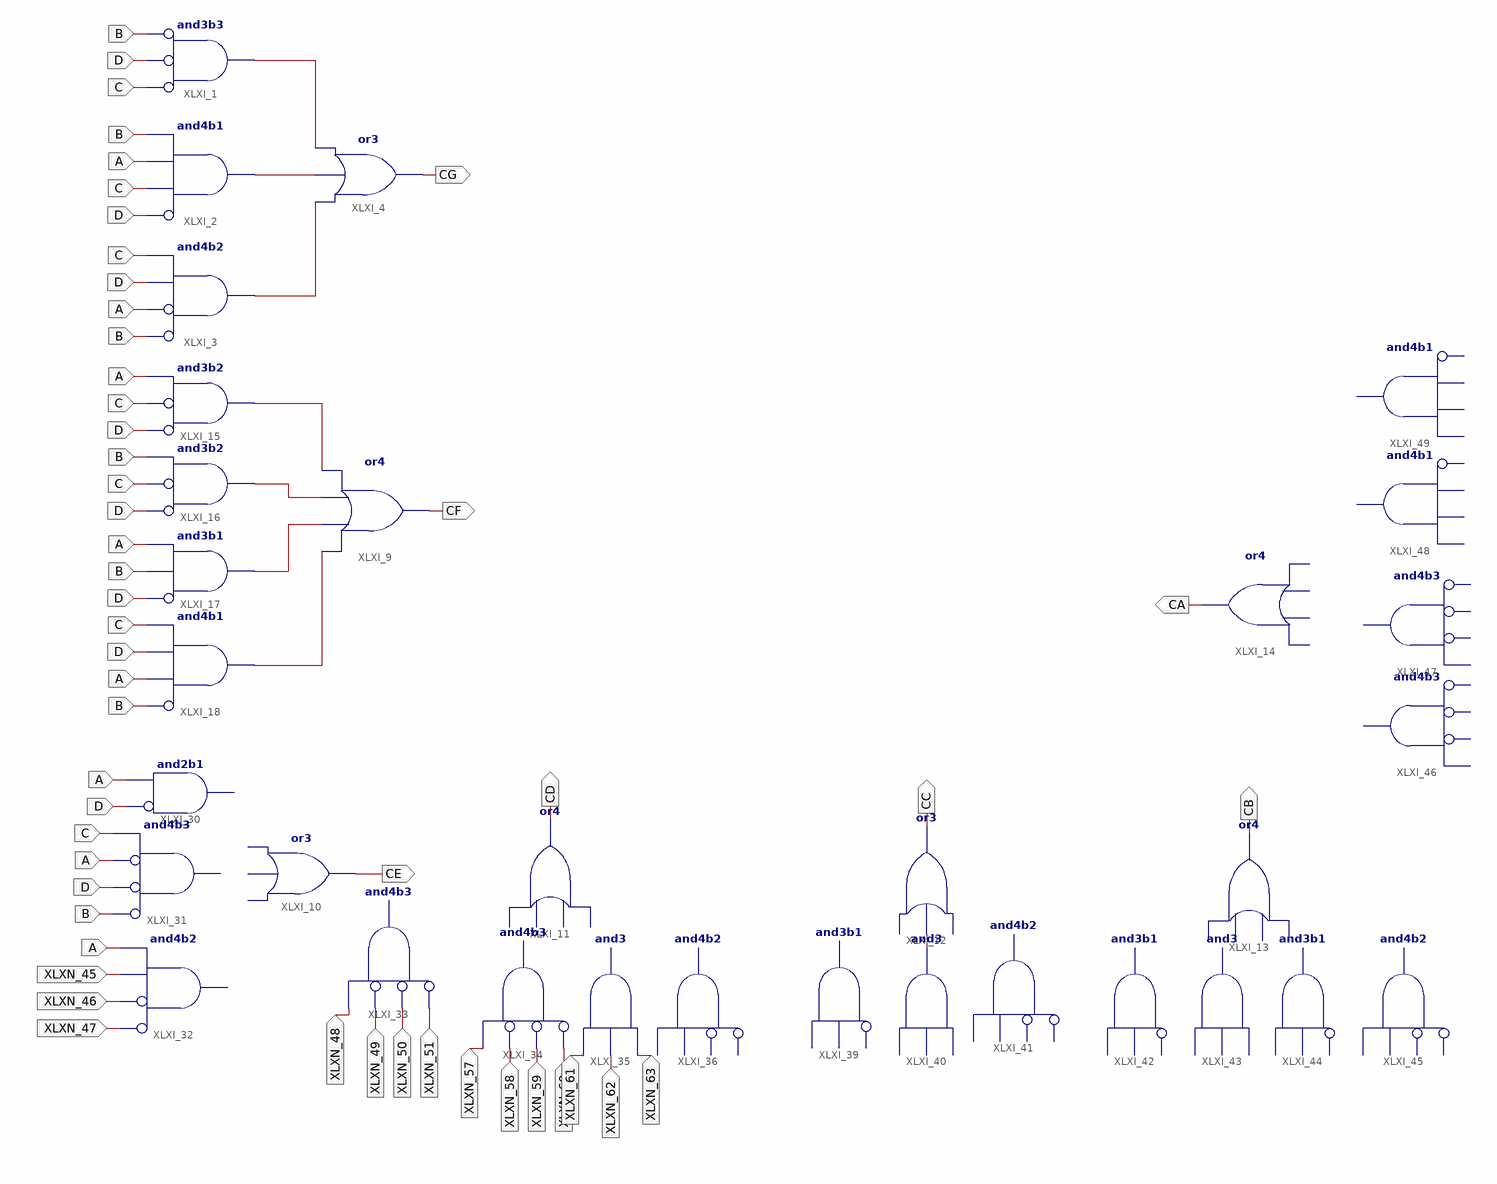
[diagram p0: schematic sheet 1]
// Xilinx ISE schematic Display.sch (spartan3e) as structural Verilog: 32 symbols, 25 ports
module Display (
  input  B,
  input  D,
  input  C,
  input  A,
  input  XLXN_45,
  input  XLXN_46,
  input  XLXN_47,
  input  XLXN_48,
  input  XLXN_49,
  input  XLXN_50,
  input  XLXN_51,
  input  XLXN_57,
  input  XLXN_58,
  input  XLXN_59,
  input  XLXN_60,
  input  XLXN_61,
  input  XLXN_62,
  input  XLXN_63,
  output CD,
  output CA,
  output CE,
  output CB,
  output CC,
  output CG,
  output CF
);

  wire XLXN_13, XLXN_64, XLXN_65, XLXN_66, XLXN_90, XLXN_91, XLXN_92, XLXN_93;

  // or4 XLXI_11 has open pins: I0=open, I1=open, I2=open, I3=open, O=CD
  // or4 XLXI_14 has open pins: I0=open, I1=open, I2=open, I3=open, O=CA
  // or3 XLXI_10 has open pins: I0=open, I1=open, I2=open, O=CE
  // and2b1 XLXI_30 has open pins: I0=D, I1=A, O=open
  // and4b3 XLXI_31 has open pins: I0=B, I1=D, I2=A, I3=C, O=open
  // and4b2 XLXI_32 has open pins: I0=XLXN_47, I1=XLXN_46, I2=XLXN_45, I3=A, O=open
  // and4b3 XLXI_34 has open pins: I0=XLXN_60, I1=XLXN_59, I2=XLXN_58, I3=XLXN_57, O=open
  // and3 XLXI_35 has open pins: I0=XLXN_63, I1=XLXN_62, I2=XLXN_61, O=open
  // and4b2 XLXI_36 is placed but not wired
  // or4 XLXI_13 has open pins: I0=open, I1=open, I2=open, I3=open, O=CB
  buf XLXI_12 (CC, XLXN_13);  // or3 open: I0, I2
  // and3b1 XLXI_39 is placed but not wired
  // and3 XLXI_40 has open pins: I0=open, I1=open, I2=open, O=XLXN_13
  // and4b2 XLXI_41 is placed but not wired
  // and3b1 XLXI_42 is placed but not wired
  // and3 XLXI_43 is placed but not wired
  // and3b1 XLXI_44 is placed but not wired
  // and4b2 XLXI_45 is placed but not wired
  // and4b3 XLXI_46 is placed but not wired
  // and4b3 XLXI_47 is placed but not wired
  // and4b1 XLXI_48 is placed but not wired
  // and4b1 XLXI_49 is placed but not wired
  // and4b3 XLXI_33 has open pins: I0=XLXN_51, I1=XLXN_50, I2=XLXN_49, I3=XLXN_48, O=open
  and XLXI_1 (XLXN_64, ~C, ~D, ~B);  // and3b3
  and XLXI_2 (XLXN_65, ~D, C, A, B);  // and4b1
  or XLXI_4 (CG, XLXN_66, XLXN_65, XLXN_64);
  and XLXI_3 (XLXN_66, ~B, ~A, D, C);  // and4b2
  or XLXI_9 (CF, XLXN_93, XLXN_92, XLXN_91, XLXN_90);
  and XLXI_15 (XLXN_90, ~D, ~C, A);  // and3b2
  and XLXI_16 (XLXN_91, ~D, ~C, B);  // and3b2
  and XLXI_17 (XLXN_92, ~D, B, A);  // and3b1
  and XLXI_18 (XLXN_93, ~B, A, D, C);  // and4b1
endmodule
